# Altium schematic sheet Overall.SchDoc
size A
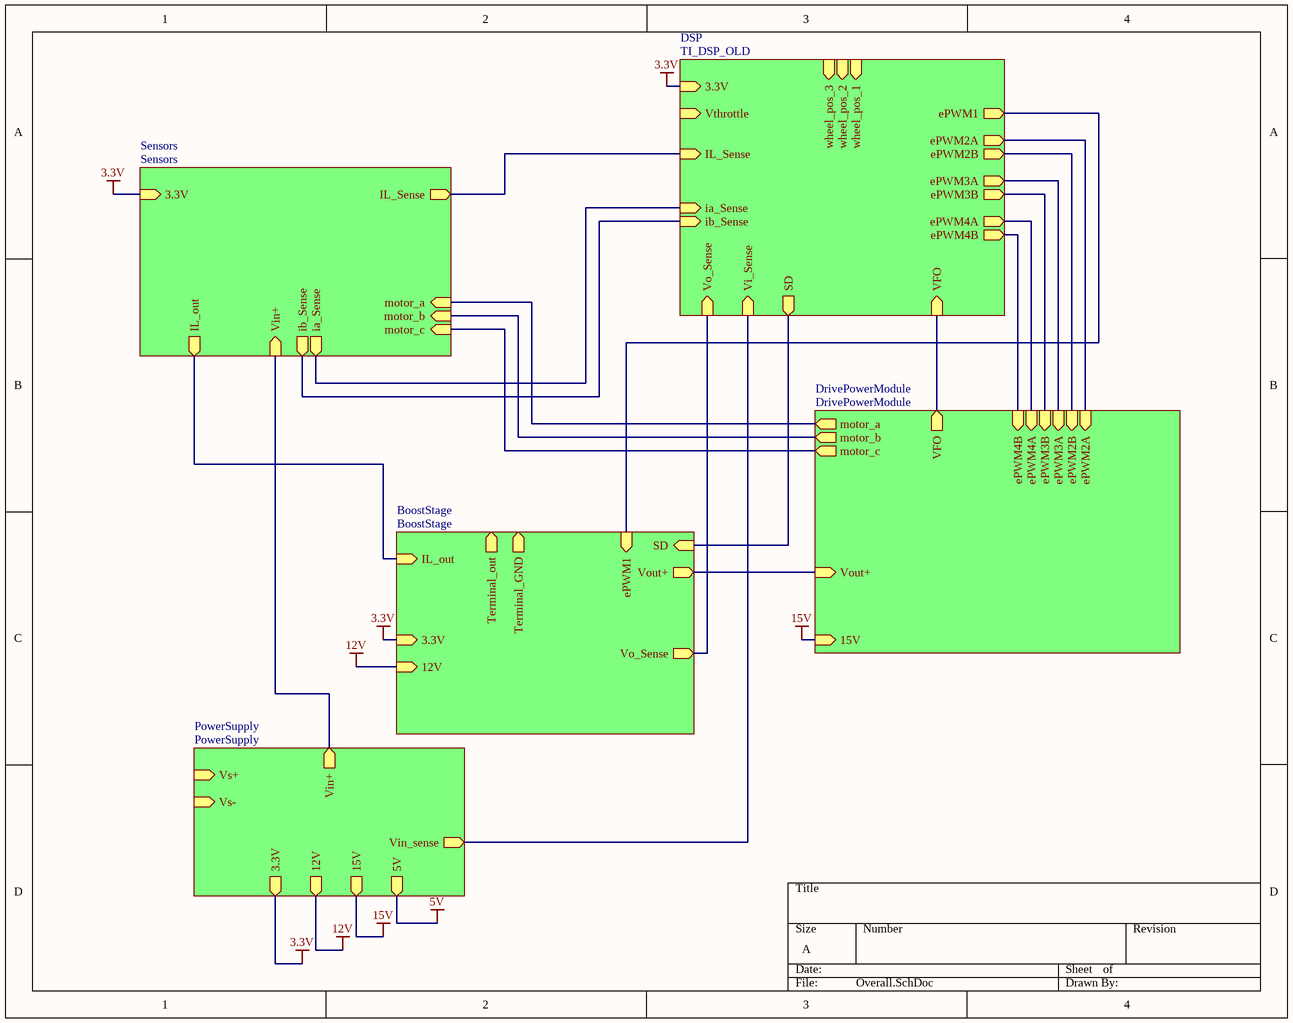
[diagram p0: Overall.SchDoc]

## Sub-sheets
BoostStage = BoostStage: IL_out (in), 12V (in), ePWM1 (in), SD (in), Terminal_out (out), Terminal_GND (out), 3.3V (in), Vout+ (out), Vo_Sense (out)
DrivePowerModule = DrivePowerModule: ePWM2A (in), ePWM2B (in), ePWM3A (in), ePWM3B (in), ePWM4A (in), ePWM4B (in), motor_b (out), motor_a (out), motor_c (out), 15V (in), VFO (out), Vout+ (in)
DSP = TI_DSP_OLD: 3.3V (in), Vi_Sense (in), Vo_Sense (in), IL_Sense (in), VFO (in), Vthrottle (in), ia_Sense (in), ib_Sense (in), SD (out), wheel_pos_1 (in), wheel_pos_2 (in), wheel_pos_3 (in), ePWM1 (out), ePWM2B (out), ePWM2A (out), ePWM3A (out), ePWM4A (out), ePWM3B (out), ePWM4B (out)
PowerSupply = PowerSupply: Vs+ (in), Vs- (in), Vin+ (out), 3.3V (out), 12V (out), 15V (out), Vin_sense (out), 5V (out)
Sensors = Sensors: 3.3V (in), ia_Sense (out), ib_Sense (out), IL_Sense (out), motor_a (in), motor_b (in), Vin+ (in), IL_out (out), motor_c (in)

## Nets
3.3V: sheet DSP/3.3V, sheet PowerSupply/3.3V, sheet BoostStage/3.3V, sheet Sensors/3.3V
5V: sheet PowerSupply/5V
12V: sheet PowerSupply/12V, sheet BoostStage/12V
15V: sheet PowerSupply/15V, sheet DrivePowerModule/15V
(unnamed): sheet DSP/Vi_Sense, sheet PowerSupply/Vin_sense
(unnamed): sheet DSP/Vo_Sense, sheet BoostStage/Vo_Sense
(unnamed): sheet DSP/IL_Sense, sheet Sensors/IL_Sense
(unnamed): sheet DSP/VFO, sheet DrivePowerModule/VFO
(unnamed): sheet DSP/ia_Sense, sheet Sensors/ia_Sense
(unnamed): sheet DSP/ib_Sense, sheet Sensors/ib_Sense
(unnamed): sheet DSP/SD, sheet BoostStage/SD
(unnamed): sheet DSP/ePWM1, sheet BoostStage/ePWM1
(unnamed): sheet DSP/ePWM2B, sheet DrivePowerModule/ePWM2B
(unnamed): sheet DSP/ePWM2A, sheet DrivePowerModule/ePWM2A
(unnamed): sheet DSP/ePWM3A, sheet DrivePowerModule/ePWM3A
(unnamed): sheet DSP/ePWM4A, sheet DrivePowerModule/ePWM4A
(unnamed): sheet DSP/ePWM3B, sheet DrivePowerModule/ePWM3B
(unnamed): sheet DSP/ePWM4B, sheet DrivePowerModule/ePWM4B
(unnamed): sheet PowerSupply/Vin+, sheet Sensors/Vin+
(unnamed): sheet BoostStage/IL_out, sheet Sensors/IL_out
(unnamed): sheet BoostStage/Vout+, sheet DrivePowerModule/Vout+
(unnamed): sheet DrivePowerModule/motor_b, sheet Sensors/motor_b
(unnamed): sheet DrivePowerModule/motor_a, sheet Sensors/motor_a
(unnamed): sheet DrivePowerModule/motor_c, sheet Sensors/motor_c